# Altium project T245_1v1.PrjPcb
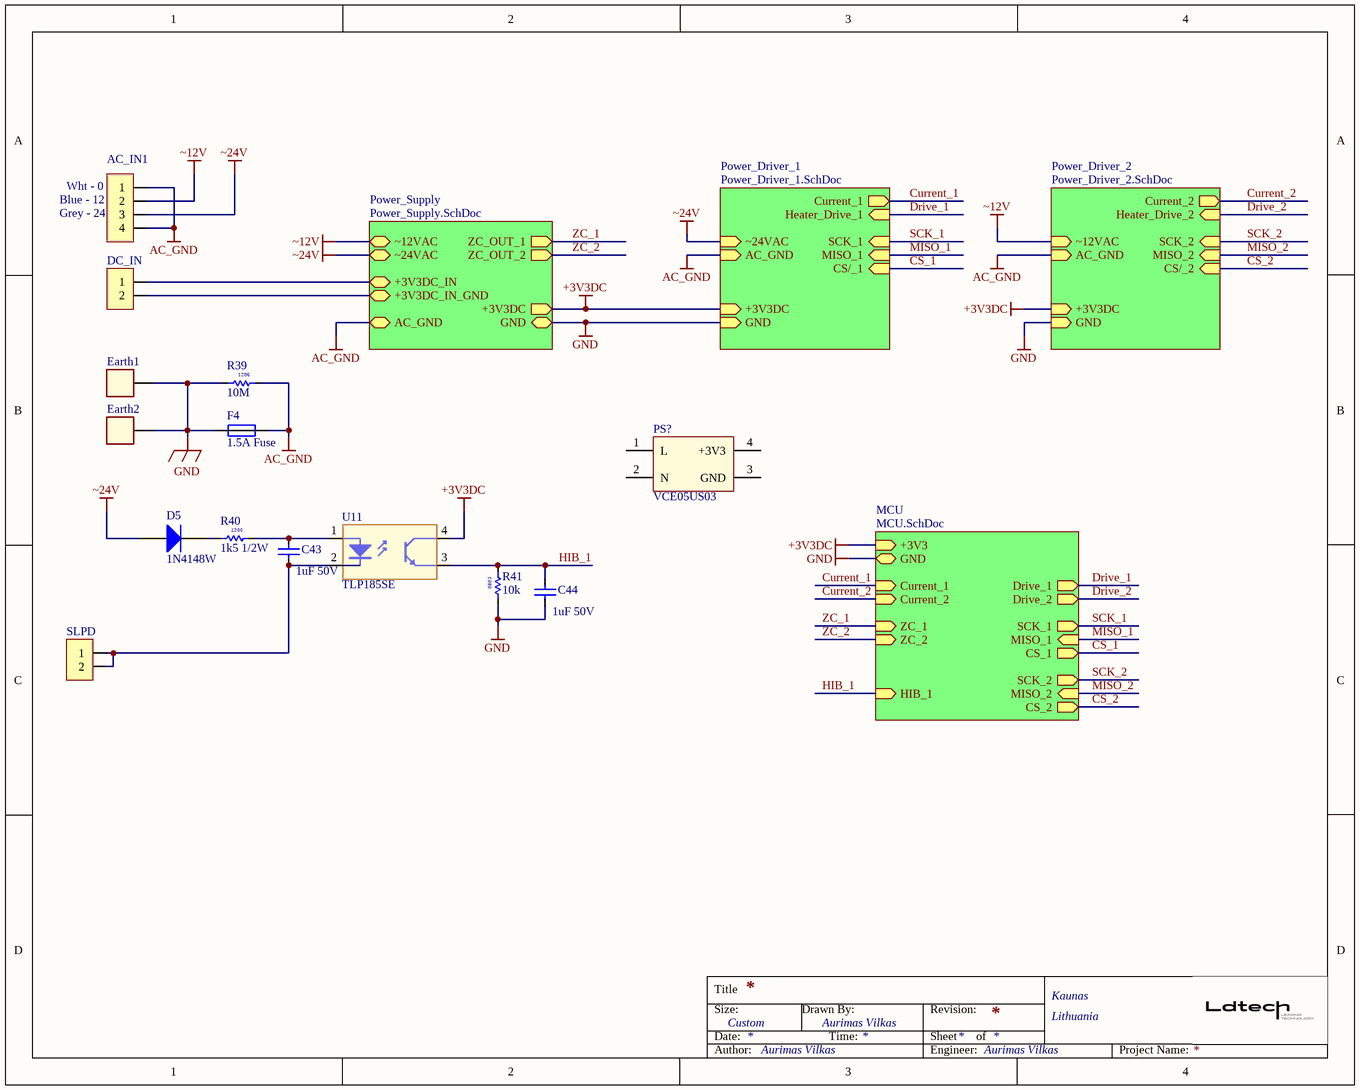
[diagram p0: T245_1v1.SchDoc]
5 sheets, 139 parts. Net scope: hierarchical (ports join the sheet entries above them; power ports are global).
Board file: T245_1v1.PcbDoc
Sheets:
  T245_1v1.SchDoc
    MCU = MCU.SchDoc
    Power_Supply = Power_Supply.SchDoc
    Power_Driver_1 = Power_Driver_1.SchDoc
    Power_Driver_2 = Power_Driver_2.SchDoc

## Sheet T245_1v1.SchDoc
size 254 x 203 mm; Author: Aurimas Vilkas; DrawnBy: Aurimas Vilkas; Engineer: Aurimas Vilkas

### Parts
AC_IN1  HDR1X4  [HDR1X4_3M96V]  (value not drawn)
C43  1uF 50V  [CAPC2012N]
C44  1uF 50V  [CAPC2012N]
D5  1N4148W  [SOD-123F]
DC_IN  HDR1X2  [HDR1X2_3M96V]  (value not drawn)
Earth1  Blade Header  [Blade header]  (value not drawn)
Earth2  Blade Header  [Blade header]  (value not drawn)
F4  1.5A Fuse  [1206F]
PS?  VCE05US03  [VCE05US03]
R39  10M  [RESC3216N]
R40  1k5 1/2W  [RESC3216N]
R41  10k  [RESC1608N]
SLPD  Sleep_Det  [HDR1X2_2.54mm]  (value not drawn)
U11  TLP185SE  [SOP-4]

### Sub-sheets
MCU = MCU.SchDoc: SCK_2 (out), +3V3 (in), Current_1 (in), Drive_2 (out), CS_1 (out), Current_2 (in), MISO_1 (in), MISO_2 (in), ZC_2 (in), CS_2 (out), SCK_1 (out), ZC_1 (in), Drive_1 (out), GND (bidir), HIB_1 (in)
Power_Driver_1 = Power_Driver_1.SchDoc: GND (in), ~24VAC (in), Current_1 (out), SCK_1 (in), +3V3DC (in), AC_GND (in), Heater_Drive_1 (in), CS/_1 (in), MISO_1 (in)
Power_Driver_2 = Power_Driver_2.SchDoc: Current_2 (out), Heater_Drive_2 (in), +3V3DC (in), AC_GND (in), MISO_2 (in), GND (in), CS/_2 (in), SCK_2 (in), ~12VAC (in)
Power_Supply = Power_Supply.SchDoc: +3V3DC (out), GND (bidir), ~24VAC (bidir), AC_GND (bidir), ZC_OUT_2 (out), ZC_OUT_1 (out), +3V3DC_IN (bidir), +3V3DC_IN_GND (bidir), ~12VAC (bidir)

### Nets
+3V3DC: U11.4(C) ; sheet MCU/+3V3, sheet Power_Supply/+3V3DC, sheet Power_Driver_1/+3V3DC, sheet Power_Driver_2/+3V3DC  [project net +3V3]
AC_GND: AC_IN1.1 AC_IN1.4 F4.1 R39.2 ; sheet Power_Supply/AC_GND, sheet Power_Driver_1/AC_GND, sheet Power_Driver_2/AC_GND  [project net TC_NEG_1]
GND: C44.2 Earth1.1 Earth2.1 F4.2 R39.1 R41.1 ; sheet MCU/GND, sheet Power_Supply/GND, sheet Power_Driver_1/GND, sheet Power_Driver_2/GND
~12V: AC_IN1.2 ; sheet Power_Supply/~12VAC, sheet Power_Driver_2/~12VAC
~24V: AC_IN1.3 D5.2 ; sheet Power_Supply/~24VAC, sheet Power_Driver_1/~24VAC
CS_1: sheet MCU/CS_1, sheet Power_Driver_1/CS/_1
CS_2: sheet MCU/CS_2, sheet Power_Driver_2/CS/_2
Current_1: sheet MCU/Current_1, sheet Power_Driver_1/Current_1
Current_2: sheet MCU/Current_2, sheet Power_Driver_2/Current_2
Drive_1: sheet MCU/Drive_1, sheet Power_Driver_1/Heater_Drive_1
Drive_2: sheet MCU/Drive_2, sheet Power_Driver_2/Heater_Drive_2
HIB_1: C44.1 R41.2 U11.3(E) ; sheet MCU/HIB_1
MISO_1: sheet MCU/MISO_1, sheet Power_Driver_1/MISO_1
MISO_2: sheet MCU/MISO_2, sheet Power_Driver_2/MISO_2
SCK_1: sheet MCU/SCK_1, sheet Power_Driver_1/SCK_1
SCK_2: sheet MCU/SCK_2, sheet Power_Driver_2/SCK_2
ZC_1: sheet MCU/ZC_1, sheet Power_Supply/ZC_OUT_1
ZC_2: sheet MCU/ZC_2, sheet Power_Supply/ZC_OUT_2
NetC35_1: DC_IN.2 ; sheet Power_Supply/+3V3DC_IN_GND
NetC43_1: C43.1 R40.2 U11.1(A)
NetC43_2: C43.2 SLPD.1 SLPD.2 U11.2(K)
NetD5_1: D5.1 R40.1
NetDC_IN_1: DC_IN.1 ; sheet Power_Supply/+3V3DC_IN

Not connected (* = marked no-connect by the designer): PS? 1(L) 2(N) 3(GND) 4(+3V3)

### Notes on the sheet
- (near AC_IN1) Blue - 12
- (near AC_IN1) Grey - 24
- (near AC_IN1) Wht - 0
- Title
- Size:
- Date:
- Custom
- Drawn By:
- Time:
- Revision:
- Sheet
- of
- Kaunas
- Lithuania
- Author:
- Engineer:
- Project Name:
- (in symbol R0000008) 0603
- (in symbol R2412076) 1206
- (in symbol R2412168) 1206

### Library data of the parts
AC_IN1 = J0000151: CONNECTOR, 4 way , HEADER, THT, 3.96MM,10A,250Vac; Supplier 1: Farnell; Supplier Part Number 1: 9492020
C43 C44 = C0000037: CL21B105KBFNNNE -  SMD Multilayer Ceramic Capacitor, 1 µF, 50 V, 0805 [2012 Metric], ± 10%, X7R, CL Series; Supplier 1: Farnell; Supplier Part Number 1: 3013482
D5 = 1N4148W: 1N4148W -  Small Signal Diode, Single, 75 V, 150 mA, 1 V, 4 ns, 400 mA; Supplier Part Number 1: 2677464; Supplier: Farnell
DC_IN = J0000152: CONNECTOR, 2 way , HEADER, THT, 3.96MM,10A,250Vac; Supplier 1: Farnell; Supplier Part Number 1: 9492003
Earth1 Earth2 = Blade Header: 62409-1 -  PCB Terminal, 6.35mm x 0.81mm, 0.25" x 0.032", Brass, 1.4 mm, Tin; Supplier 1: Farnell; Supplier Part Number 1: 892609
F4 = 1.5A Fuse: MCCFB1206TFF/1.5 -  Fuse, Surface Mount, 1.5 A, 32 V, Fast Acting, 1206; Supplier 1: Farnell; Supplier Part Number 1: 1652166
PS? = VCE05US03: VCE05US03 -  AC/DC PCB Mount Power Supply (PSU), ITE, 1 Output, 5 W, 3.3 V, 1.21 A; Supplier 1: Farnell; Supplier Part Number 1: 2671557
R39 = R2412168: CRGCQ1206J10M -  SMD Chip Resistor, 1206 [3216 Metric], 10 Mohm, CRGCQ Series, 200 V, Thick Film, 250 mW; Supplier 1: Farnell; Supplier Part Number 1: 2861974
R40 = R2412076: MCWF12P1501FTL -  SMD Chip Resistor, 1206 [3216 Metric], 1.5 kohm, MCWF12P Series, 200 V, Thick Film, 500 mW; Supplier 1: Farnell; Supplier Part Number 1: 2694448
R41 = R0000008: MCWR06X1002FTL -  SMD Chip Resistor, 0603 [1608 Metric], 10 kohm, MCWR Series, 50 V, Thick Film, 100 mW; Supplier 1: Farnell; Supplier Part Number 1: 2447230
SLPD = J0000013: 2 header, 2.54mm; Supplier 1: Farnell; Supplier Part Number 1: 1248140
U11 = TLP185SE: TLP185(GR-TPL,SE(T -  Optocoupler, 1 Channel, SOP, 4 Pins, 50 mA, 3.75 kV, 100 %; Supplier 1: Farnell; Supplier Part Number 1: 3014097

## Sheet MCU.SchDoc
size 254 x 203 mm; Author: Aurimas Vilkas; DrawnBy: Aurimas Vilkas; Engineer: Aurimas Vilkas
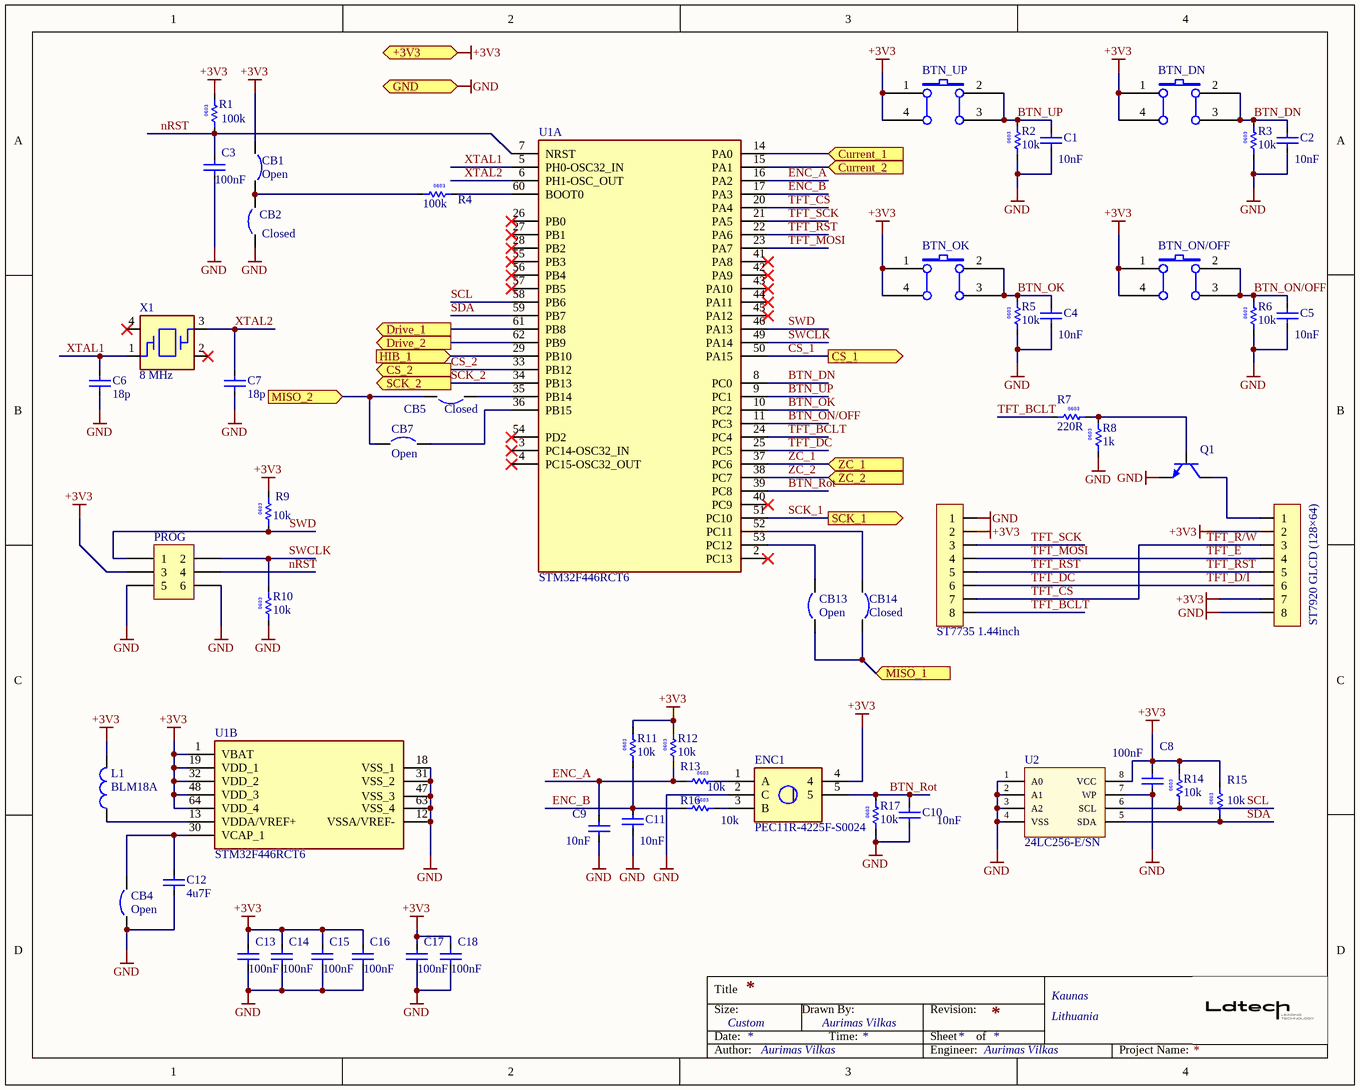
[diagram p1: MCU.SchDoc]

### Parts
BTN_DN  Button  [PB-6X6mm]  (value not drawn)
BTN_OK  Button  [PB-6X6mm]  (value not drawn)
BTN_ON/OFF  Button  [PB-6X6mm]  (value not drawn)
BTN_UP  Button  [PB-6X6mm]  (value not drawn)
C1  10nF  [CAPC1608N]
C2  10nF  [CAPC1608N]
C3  100nF  [CAPC1608N]
C4  10nF  [CAPC1608N]
C5  10nF  [CAPC1608N]
C6  18p  [CAPC1608N]
C7  18p  [CAPC1608N]
C8  100nF  [CAPC1608N]
C9  10nF  [CAPC1608N]
C10  10nF  [CAPC1608N]
C11  10nF  [CAPC1608N]
C12  4u7F  [CAPC1608N]
C13  100nF  [CAPC1608N]
C14  100nF  [CAPC1608N]
C15  100nF  [CAPC1608N]
C16  100nF  [CAPC1608N]
C17  100nF  [CAPC1608N]
C18  100nF  [CAPC1608N]
CB1  Open  [CB_0603]
CB2  Closed  [CB_0603]
CB4  Open  [CB_0603]
CB5  Closed  [CB_0603]
CB7  Open  [CB_0603]
CB13  Open  [CB_0603]
CB14  Closed  [CB_0603]
ENC1  PEC11R-4225F-S0024  [PEC12R-4XXXF-SXXXX_1]
L1  BLM18A  [0603L]
PROG  PROG  [B6B_SMT]  (value not drawn)
Q1  FMMT493ATA  [SOT23-3]  (value not drawn)
R1  100k  [RESC1608N]
R2  10k  [RESC1608N]
R3  10k  [RESC1608N]
R4  100k  [RESC1608N]
R5  10k  [RESC1608N]
R6  10k  [RESC1608N]
R7  220R  [RESC1608N]
R8  1k  [RESC1608N]
R9  10k  [RESC1608N]
R10  10k  [RESC1608N]
R11  10k  [RESC1608N]
R12  10k  [RESC1608N]
R13  10k  [RESC1608N]
R14  10k  [RESC1608N]
R15  10k  [RESC1608N]
R16  10k  [RESC1608N]
R17  10k  [RESC1608N]
ST7735_1.44inch  ST7735 1.44inch  [B8B-XH-A (LF)(SN)]  (value not drawn)
ST7920_GLCD_(128×64)  ST7920 GLCD (128×64)  [B8B-XH-A (LF)(SN)]  (value not drawn)
U1  STM32F446RCT6  [LQFP-64N]  (parts A,B of 2)
U2  24LC256-E/SN  [SOIC-8]
X1  8 MHz  [2SMX-3SMXB]

### Ports
+3V3 (in), CS_1 (out), CS_2 (out), Current_1 (in), Current_2 (in), Drive_1 (out), Drive_2 (out), GND (bidir), HIB_1 (in), MISO_1 (in), MISO_2 (in), SCK_1 (out), SCK_2 (out), ZC_1 (in), ZC_2 (in)

### Nets
+3V3: BTN_DN.1(A0) BTN_DN.4(A1) BTN_OK.1(A0) BTN_OK.4(A1) BTN_ON/OFF.1(A0) BTN_ON/OFF.4(A1) BTN_UP.1(A0) BTN_UP.4(A1) C8.2 C13.2 C14.2 C15.2 C16.2 C17.2 C18.2 CB1.1 ENC1.4 L1.2 PROG.3 R1.2 R9.2 R11.2 R12.2 R14.2 R15.2 ST7735_1.44inch.2 ST7920_GLCD_(128×64).2 ST7920_GLCD_(128×64).7 U1.1(VBAT) U1.19(VDD_1) U1.32(VDD_2) U1.48(VDD_3) U1.64(VDD_4) U2.8(VCC) ; port +3V3
GND: C1.2 C2.2 C3.1 C4.2 C5.2 C6.1 C7.1 C8.1 C9.2 C10.2 C11.2 C12.1 C13.1 C14.1 C15.1 C16.1 C17.1 C18.1 CB2.1 CB4.1 ENC1.2(C) PROG.5 PROG.6 Q1.2(E) R2.1 R3.1 R5.1 R6.1 R8.1 R10.1 R17.1 ST7735_1.44inch.1 ST7920_GLCD_(128×64).8 U1.12(VSSA/VREF-) U1.18(VSS_1) U1.31(VSS_2) U1.47(VSS_3) U1.63(VSS_4) U2.1(A0) U2.2(A1) U2.3(A2) U2.4(VSS) U2.7(WP) ; port GND
BTN_DN: BTN_DN.2(B0) BTN_DN.3(B1) C2.1 R3.2 U1.8(PC0)
BTN_OK: BTN_OK.2(B0) BTN_OK.3(B1) C4.1 R5.2 U1.10(PC2)
BTN_ON/OFF: BTN_ON/OFF.2(B0) BTN_ON/OFF.3(B1) C5.1 R6.2 U1.11(PC3)
BTN_Rot: C10.1 ENC1.5 R17.2 U1.39(PC8)
BTN_UP: BTN_UP.2(B0) BTN_UP.3(B1) C1.1 R2.2 U1.9(PC1)
CS_1: U1.50(PA15) ; port CS_1
CS_2: U1.33(PB12) ; port CS_2
Current_1: U1.14(PA0) ; port Current_1
Current_2: U1.15(PA1) ; port Current_2
Drive_1: U1.61(PB8) ; port Drive_1
Drive_2: U1.62(PB9) ; port Drive_2
ENC_A: C9.1 R12.1 R13.1 U1.16(PA2)
ENC_B: C11.1 R11.1 R16.1 U1.17(PA3)
HIB_1: U1.29(PB10) ; port HIB_1
MISO_1: CB13.1 CB14.2 ; port MISO_1
MISO_2: CB5.2 CB7.1 ; port MISO_2
nRST: C3.2 PROG.4 R1.1 U1.7(NRST)
SCK_1: U1.51(PC10) ; port SCK_1
SCK_2: U1.34(PB13) ; port SCK_2
SCL: R14.1 U1.58(PB6) U2.6(SCL)
SDA: R15.1 U1.59(PB7) U2.5(SDA)
SWCLK: PROG.2 R10.2 U1.49(PA14)
SWD: PROG.1 R9.1 U1.46(PA13)
TFT_BCLT: R7.1 ST7735_1.44inch.8 U1.24(PC4)
TFT_CS: ST7735_1.44inch.7 ST7920_GLCD_(128×64).3 U1.20(PA4)  [also labelled TFT_R/W]
TFT_D/I: ST7735_1.44inch.6 ST7920_GLCD_(128×64).6 U1.25(PC5)  [also labelled TFT_DC]
TFT_E: ST7735_1.44inch.4 ST7920_GLCD_(128×64).4 U1.23(PA7)  [also labelled TFT_MOSI]
TFT_RST: ST7735_1.44inch.5 ST7920_GLCD_(128×64).5 U1.22(PA6)
TFT_SCK: ST7735_1.44inch.3 U1.21(PA5)
XTAL1: C6.2 U1.5(PH0-OSC32_IN) X1.1
XTAL2: C7.2 U1.6(PH1-OSC_OUT) X1.3
ZC_1: U1.37(PC6) ; port ZC_1
ZC_2: U1.38(PC7) ; port ZC_2
NetC12_2: C12.2 CB4.2 U1.30(VCAP_1)
NetCB1_2: CB1.2 CB2.2 R4.1
NetCB5_1: CB5.1 U1.35(PB14)
NetCB7_2: CB7.2 U1.36(PB15)
NetCB13_2: CB13.2 U1.53(PC12)
NetCB14_1: CB14.1 U1.52(PC11)
NetENC1_1: ENC1.1(A) R13.2
NetENC1_3: ENC1.3(B) R16.2
NetL1_1: L1.1 U1.13(VDDA/VREF+)
NetQ1_1: Q1.1(B) R7.2 R8.2
NetQ1_3: Q1.3(C) ST7920_GLCD_(128×64).1
NetR4_2: R4.2 U1.60(BOOT0)

Not connected (* = marked no-connect by the designer): U1 2(PC13)* 3(PC14-OSC32_IN)* 4(PC15-OSC32_OUT)* 26(PB0)* 27(PB1)* 28(PB2)* 40(PC9)* 41(PA8)* 42(PA9)* 43(PA10)* 44(PA11)* 45(PA12)* 54(PD2)* 55(PB3)* 56(PB4)* 57(PB5)*; X1 2* 4*

### Notes on the sheet
- Title
- Size:
- Date:
- Custom
- Drawn By:
- Time:
- Revision:
- Sheet
- of
- Kaunas
- Lithuania
- Author:
- Engineer:
- Project Name:
- (in symbol R0000008) 0603
- (in symbol R2406056) 0603
- (in symbol R2406120) 0603

### Library data of the parts
BTN_DN BTN_OK BTN_ON/OFF BTN_UP = Tactile PB: FSM2JRT -  Tactile Switch, Non Illuminated, 24 V, 50 mA, 225 gf, PC Pin, FSM Series; Supplier 1: Farnell; Supplier Part Number 1: 2610957
C1 C2 C4 C5 C9-C11 = C0000009: MCU0603R103KCT -  SMD Multilayer Ceramic Capacitor, 10000 pF, 50 V, 0603 [1608 Metric], ± 10%, X7R, MCU Series; Supplier 1: Farnell; Supplier Part Number 1: 9406182
C3 C8 C13-C18 = C0000005: MC0805B104K250CT -  SMD Multilayer Ceramic Capacitor, 0.1 µF, 25 V, 0805 [2012 Metric], ± 10%, X7R, MC Series; Supplier 1: Farnell; Supplier Part Number 1: 1759166
C6 C7 = C0000124: 0603N180J500CT -  SMD Multilayer Ceramic Capacitor, 0603 [1608 Metric], 18 pF, 50 V, ± 5%, C0G / NP0; Supplier 1: Farnell; Supplier Part Number 1: 2496890
C12 = C0000005: CL10A475KQ8NNNC -  SMD Multilayer Ceramic Capacitor, 4.7 µF, 6.3 V, 0603 [1608 Metric], ± 10%, X5R, CL Series; Supplier 1: Farnell; Supplier Part Number 1: 3013399
CB1 CB4 CB7 CB13 = CB Open: Circuit Breaker; Revision: July-2002: Re-released for DXP Platform.
CB2 CB5 CB14 = CB Closed: Circuit Breaker; Revision: July-2002: Re-released for DXP Platform.
ENC1 = PEC11R-4225F-S0024: PEC11R-4225F-S0024 -  Rotary Encoder, Mechanical, Incremental, 24 PPR, 24 Detents, Vertical, With Momentary Push Switch; Supplier Part Number 1: 2381866; Supplier 1: Farnell
L1 = BLM18AG601SN1D: BLM18AG601SN1D -  Ferrite Bead, 0603 [1608 Metric], 600 ohm, 500 mA, BLM18A Series, 0.38 ohm, ± 25%; Supplier 1: Farnell; Supplier Part Number 1: 1515679
PROG = B6B_SMT: 1241050-3 -  Board-To-Board Connector, 2.54 mm, 6 Contacts, Header, AMPMODU MOD II Series, Surface Mount, 2 Rows; Supplier 1: Farnell; Supplier Part Number 1: 9689567
Q1 = FMMT493ATA: FMMT493ATA -  Bipolar (BJT) Single Transistor, NPN, 60 V, 150 MHz, 500 mW, 1 A, 300 hFE; Supplier Part Number 1: 2061448; Supplier 1: Farnell
R1 R4 = R2406120: MCWR06X1003FTL -  SMD Chip Resistor, 0603 [1608 Metric], 100 kohm, MCWR Series, 50 V, Thick Film, 100 mW; Supplier 1: Farnell; Supplier Part Number 1: 2447226RL
R2 R3 R5 R6 R9-R17 = R0000008: as R41 on sheet T245_1v1; Supplier 1: Farnell; Supplier Part Number 1: 2447230
R7 = R2406056: CRGH0603F220R -  SMD Chip Resistor, 220 ohm, CRG Series, 50 V, Thick Film, 0603 [1608 Metric], 200 mW; Supplier 1: Farnell; Supplier Part Number 1: 2331993
R8 = R2406056: CRGH0603F1K0 -  SMD Chip Resistor, 1 kohm, CRG Series, 50 V, Thick Film, 0603 [1608 Metric], 200 mW; Supplier 1: Farnell; Supplier Part Number 1: 2332003
ST7735_1.44inch ST7920_GLCD_(128×64) = B8B-XH-A: B8B-XH-A (LF)(SN) -  Wire-To-Board Connector, Vertical, 2.5 mm, 8 Contacts, Header, XH Series, Through Hole, 1 Rows; Supplier 1: Farnell; Supplier Part Number 1: 1516284
U1 = STM32F446RCT6TR: STM32F446RCT6 -  ARM MCU, High Performance, STM32 Family STM32F4 Series Microcontrollers, ARM Cortex-M4, 32bit; Kitron: 4110530; Supplier 1: Farnell; Supplier Part Number 1: 2488309
U2 = 24LC256-E/SN: 24LC256-E/SN -  EEPROM, 256 Kbit, 32K x 8bit, Serial I2C (2-Wire), 400 kHz, SOIC, 8 Pins; Supplier Part Number 1: 1579573; Supplier 1: Farnell
X1 = M0000014: CRYSTAL, 8M, 18PF CL, 6X3.6MM SMT; Supplier 1: Farnell; Supplier Part Number 1: 1611803

## Sheet Power_Supply.SchDoc
size 254 x 203 mm; Author: Aurimas Vilkas; DrawnBy: Aurimas Vilkas; Engineer: Aurimas Vilkas
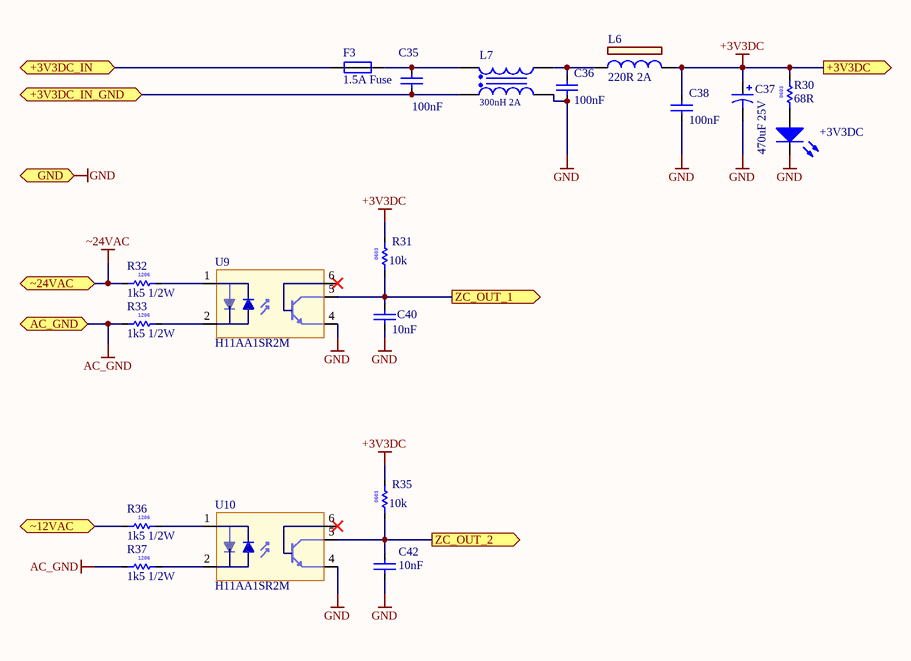
[diagram p2: Power_Supply.SchDoc]

### Parts
+3V3DC  Green LED  [LED_GRN]  (value not drawn)
C35  100nF  [CAPC1608N]
C36  100nF  [CAPC1608N]
C37  470uF 25V  [10X10.5]
C38  100nF  [CAPC1608N]
C40  10nF  [CAPC1608N]
C42  10nF  [CAPC1608N]
F3  1.5A Fuse  [1206F]
L6  220R 2A  [LL0805\2P]
L7  300nH 2A  [1812_CM_WE]
R30  68R  [RESC1608N]
R31  10k  [RESC1608N]
R32  1k5 1/2W  [RESC3216N]
R33  1k5 1/2W  [RESC3216N]
R35  10k  [RESC1608N]
R36  1k5 1/2W  [RESC3216N]
R37  1k5 1/2W  [RESC3216N]
U9  H11AA1SR2M  [SMDIP-6]
U10  H11AA1SR2M  [SMDIP-6]

### Ports
+3V3DC (out), +3V3DC_IN (bidir), +3V3DC_IN_GND (bidir), AC_GND (bidir), GND (bidir), ZC_OUT_1 (out), ZC_OUT_2 (out), ~12VAC (bidir), ~24VAC (bidir)

### Nets
+3V3DC: C37.1 C38.2 L6.2 R30.2 R31.2 R35.2 ; port +3V3DC  [project net +3V3]
AC_GND: R33.1 R37.1 ; port AC_GND  [project net TC_NEG_1]
GND: +3V3DC.2(K) C36.1 C37.2 C38.1 C40.2 C42.2 L7.2 U9.4(E) U10.4(E) ; port GND
~12V: R36.1 ; port ~12VAC
~24VAC: R32.1 ; port ~24VAC  [project net ~24V]
ZC_1: C40.1 R31.1 U9.5(C) ; port ZC_OUT_1
ZC_2: C42.1 R35.1 U10.5(C) ; port ZC_OUT_2
Net+3V3DC_1: +3V3DC.1(A) R30.1
NetC35_1: C35.1 L7.1 ; port +3V3DC_IN_GND
NetC35_2: C35.2 F3.2 L7.4
NetC36_2: C36.2 L6.1 L7.3
NetDC_IN_1: F3.1 ; port +3V3DC_IN
NetR32_2: R32.2 U9.1(A)
NetR33_2: R33.2 U9.2(K)
NetR36_2: R36.2 U10.1(A)
NetR37_2: R37.2 U10.2(K)

Not connected (* = marked no-connect by the designer): U9 6(B)*; U10 6(B)*

### Notes on the sheet
- Title
- Size:
- Date:
- Custom
- Drawn By:
- Time:
- Revision:
- Sheet
- of
- Kaunas
- Lithuania
- Author:
- Engineer:
- Project Name:
- (in symbol R0000002) 0603
- (in symbol R0000008) 0603
- (in symbol R2412076) 1206

### Library data of the parts
+3V3DC = KPT-2012SGC: KPT-2012SGC -  LED, Low Power, Green, SMD, 2mm x 1.25mm, 20 mA, 2.2 V, 568 nm; Supplier 1: Farnell; Supplier Part Number 1: 2099239
C35 C36 C38 = C0000005: as C3 on sheet MCU; Supplier 1: Farnell; Supplier Part Number 1: 1759166
C37 = 470uF 25V: MCVVT025M471GB3L -  SMD Aluminium Electrolytic Capacitor, Radial Can - SMD, 470 µF, 25 V, VT, V-Chip Series; Supplier 1: Farnell; Supplier Part Number 1: 2611378
C40 C42 = C0000009: as C1 on sheet MCU; Supplier 1: Farnell; Supplier Part Number 1: 9406182
F3 = 1.5A Fuse: as F4 on sheet T245_1v1; Supplier 1: Farnell; Supplier Part Number 1: 1652166
L6 = L0000004: BLM21PG221SN1D -  Ferrite Bead, 0805 [2012 Metric], 220 ohm, 2 A, BLM21P Series, 0.045 ohm, ± 25%; Supplier 1: Farnell; Supplier Part Number 1: 1515661
L7 = 300 nH: 744235900 -  Filter, Line, Common Mode, 300 nH, WE-CNSW Series, 90 ohm, 2 A, 4.5mm x 3.2mm x 2.8mm; Supplier 1: Farnell; Supplier Part Number 1: 2249865
R30 = R0000002: MCSR06X68R0FTL -  SMD Chip Resistor, 68 ohm, MCSR 06 Series, 75 V, Ceramic, 0603 [1608 Metric], 100 mW; Supplier 1: Farnell; Supplier Part Number 1: 2074301
R31 R35 = R0000008: as R41 on sheet T245_1v1; Supplier 1: Farnell; Supplier Part Number 1: 2447230
R32 R33 R36 R37 = R2412076: as R40 on sheet T245_1v1; Supplier 1: Farnell; Supplier Part Number 1: 2694448
U9 U10 = H11AA1SR2M: H11AA1SR2M -  Optocoupler, Transistor Output, 1 Channel, Surface Mount DIP, 6 Pins, 60 mA, 7.5 kV, 20 %; Supplier 1: Farnell; Supplier Part Number 1: 2322525

## Sheet Power_Driver_1.SchDoc
size 254 x 203 mm; Author: Aurimas Vilkas; DrawnBy: Aurimas Vilkas; Engineer: Aurimas Vilkas
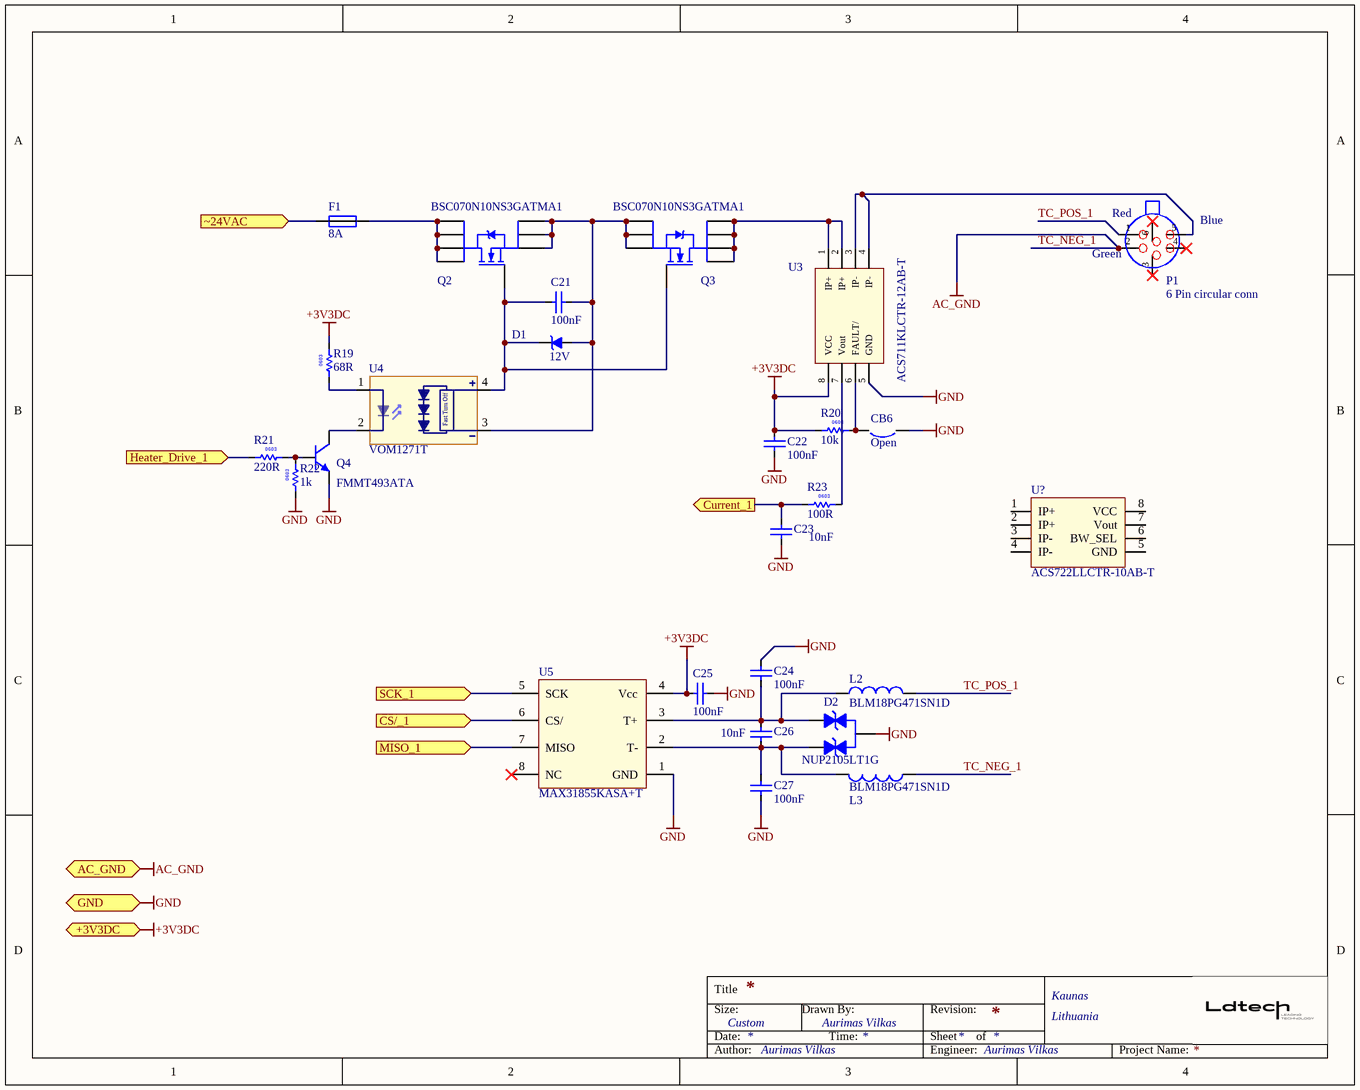
[diagram p3: Power_Driver_1.SchDoc]

### Parts
C21  100nF  [CAPC1608N]
C22  100nF  [CAPC1608N]
C23  10nF  [CAPC1608N]
C24  100nF  [CAPC1608N]
C25  100nF  [CAPC1608N]
C26  10nF  [CAPC1608N]
C27  100nF  [CAPC1608N]
CB6  Open  [CB_0603]
D1  12V  [SOD-80C]
D2  NUP2105LT1G  [SOT23-3]
F1  8A  [1206F]
L2  BLM18PG471SN1D  [LL0603\2P]
L3  BLM18PG471SN1D  [LL0603\2P]
P1  6 Pin circular conn  [RPC1-12RB-6P(71)]
Q2  BSC070N10NS3GATMA1  [PG-TDSON-8]
Q3  BSC070N10NS3GATMA1  [PG-TDSON-8]
Q4  FMMT493ATA  [SOT23-3]
R19  68R  [RESC1608N]
R20  10k  [RESC1608N]
R21  220R  [RESC1608N]
R22  1k  [RESC1608N]
R23  100R  [RESC1608N]
U3  ACS711KLCTR-12AB-T  [SOIC-8]
U4  VOM1271T  [SOP-4]
U5  MAX31855KASA+T  [SOIC-8]
U?  ACS722LLCTR-10AB-T  [SOIC-8]

### Ports
+3V3DC (in), AC_GND (in), CS/_1 (in), Current_1 (out), GND (in), Heater_Drive_1 (in), MISO_1 (in), SCK_1 (in), ~24VAC (in)

### Nets
+3V3DC: C22.2 C25.1 R19.2 R20.1 U3.8(VCC) U5.4(Vcc) ; port +3V3DC  [project net +3V3]
GND: C22.1 C23.2 C24.2 C25.2 C27.1 CB6.1 D2.3 Q4.2(E) R22.1 U3.5(GND) U5.1(GND) ; port GND
TC_NEG_1: L3.1 P1.2 ; port AC_GND  [also labelled AC_GND]
~24V: F1.2 ; port ~24VAC
CS_1: U5.6(CS/) ; port CS/_1
Current_1: C23.1 R23.1 ; port Current_1
Drive_1: R21.1 ; port Heater_Drive_1
MISO_1: U5.7(MISO) ; port MISO_1
SCK_1: U5.5(SCK) ; port SCK_1
TC_POS_1: L2.2 P1.1
NetC21_1: C21.1 D1.2(A) Q2.3(S) Q3.3(S) U4.3(K)
NetC21_2: C21.2 D1.1(K) Q2.1(G) Q3.1(G) U4.4(E)
NetC24_1: C24.1 C26.1 D2.2 L2.1 U5.3(T+)
NetC26_2: C26.2 C27.2 D2.1 L3.2 U5.2(T-)
NetCB6_2: CB6.2 R20.2 U3.6(FAULT/)
NetF1_1: F1.1 Q2.2(D)
NetP1_5: P1.5 U3.3(IP-) U3.4(IP-)
NetQ3_2: Q3.2(D) U3.1(IP+) U3.2(IP+)
NetQ4_1: Q4.1(B) R21.2 R22.2
NetQ4_3: Q4.3(C) U4.2(K)
NetR19_1: R19.1 U4.1(A)
NetR23_2: R23.2 U3.7(Vout)

Not connected (* = marked no-connect by the designer): P1 3* 4* 6*; U5 8(NC)*; U? 1(IP+) 2(IP+) 3(IP-) 4(IP-) 5(GND) 6(BW_SEL) 7(Vout) 8(VCC)

### Notes on the sheet
- (near P1) Red
- (near P1) Blue
- (near P1) Green
- Title
- Size:
- Date:
- Custom
- Drawn By:
- Time:
- Revision:
- Sheet
- of
- Kaunas
- Lithuania
- Author:
- Engineer:
- Project Name:
- (in symbol R0000002) 0603
- (in symbol R0000008) 0603
- (in symbol R2406048) 0603
- (in symbol R2406056) 0603
- (in symbol VOM1271T) Fast Turn Off

### Library data of the parts
C21 C22 C24 C25 C27 = C0000005: as C3 on sheet MCU; Supplier 1: Farnell; Supplier Part Number 1: 1759166
C23 C26 = C0000009: as C1 on sheet MCU; Supplier 1: Farnell; Supplier Part Number 1: 9406182
CB6 = CB Open: Circuit Breaker; Revision: July-2002: Re-released for DXP Platform.
D1 = 12V: BZT55C12-GS08 -  Zener Single Diode, 12 V, 500 mW, SOD-80 (MiniMELF), 5 %, 2 Pins, 175 °C; Supplier 1: Farnell; Supplier Part Number 1: 2690028
D2 = NUP2105LT1G: NUP2105LT1G -  TVS Diode, NUP21 Series, Bidirectional, 22 V, 40 V, SOT-23, 3 Pins; Supplier Part number 1: 2101833; Supplier 1: Farnell
F1 = 8A Fuse: MCCFB1206TFF/8 -  Fuse, Surface Mount, 8 A, 32 V, Fast Acting, 1206; Supplier Part Number 1: 2850026; Supplier 1: Farnell
L2 L3 = L0000158: BLM18PG471SN1D -  Ferrite Bead, 0603 [1608 Metric], 470 ohm, 1 A, BLM18P Series, 0.2 ohm, ± 25%; Supplier 1: Farnell; Supplier Part Number 1: 1515745
P1 = RPC1-12RB-6P(71): RPC1-12RB-6P(71) -  Circular Connector, RP Series, Panel Mount Receptacle, 6 Contacts, Solder Pin; Supplier Part Number 1: 1077728; Supplier 1: Farnell
Q2 Q3 = BSC070N10NS3GATMA1: BSC070N10NS3GATMA1 -  Power MOSFET, N Channel, 100 V, 90 A, 0.0063 ohm, TDSON, Surface Mount; Kitron: 4084118; Supplier Part Number 1: 2443421; Supplier 1: Farnell
Q4 = FMMT493ATA: as Q1 on sheet MCU; Supplier Part Number 1: 2061448; Supplier 1: Farnell
R19 = R0000002: as R30 on sheet Power_Supply; Supplier 1: Farnell; Supplier Part Number 1: 2074301
R20 = R0000008: as R41 on sheet T245_1v1; Supplier 1: Farnell; Supplier Part Number 1: 2447230
R21 = R2406056: as R7 on sheet MCU; Supplier 1: Farnell; Supplier Part Number 1: 2331993
R22 = R2406056: as R8 on sheet MCU; Supplier 1: Farnell; Supplier Part Number 1: 2332003
R23 = R2406048: MCHVR03JTEX1000 -  SMD Chip Resistor, High Voltage, 100 ohm, HVR Series, 200 V, Thick Film, 0603 [1608 Metric], 100 mW; Supplier 1: Farnell; Supplier Part Number 1: 2825696
U3 = ACS711KLCTR-12AB-T: ACS711KLCTR-12AB-T -  Current Sensor, Overcurrent Fault, 4 mA, 100 kHz, SOIC, 8 Pins, 3 V, 5.5 V; Supplier Part Number 1: 2057423; Supplier 1: Farnell
U4 = VOM1271T: VOM1271T -  Photovoltaic MOSFET Driver, Integrated Fast Turn-Off, Solid-State Relay 47µA Out, 24 µs Delay, SOP-4; Supplier Part Number 1: 2395899; Supplier 1: Farnell
U5 = MAX31855KASA+T: MAX31855KASA+T -  Temperature Sensor IC, Thermocouple, Digital, ± 2°C, -200 °C, 1350 °C, NSOIC, 8 Pins; Supplier 1: Farnell; Supplier Part Number 1: 2515622
U? = ACS722LLCTR-10AB-T: SENSOR CURRENT HALL 10A AC/DC; Supplier 1: Digi-Key

## Sheet Power_Driver_2.SchDoc
size 254 x 203 mm; Author: Aurimas Vilkas; DrawnBy: Aurimas Vilkas; Engineer: Aurimas Vilkas
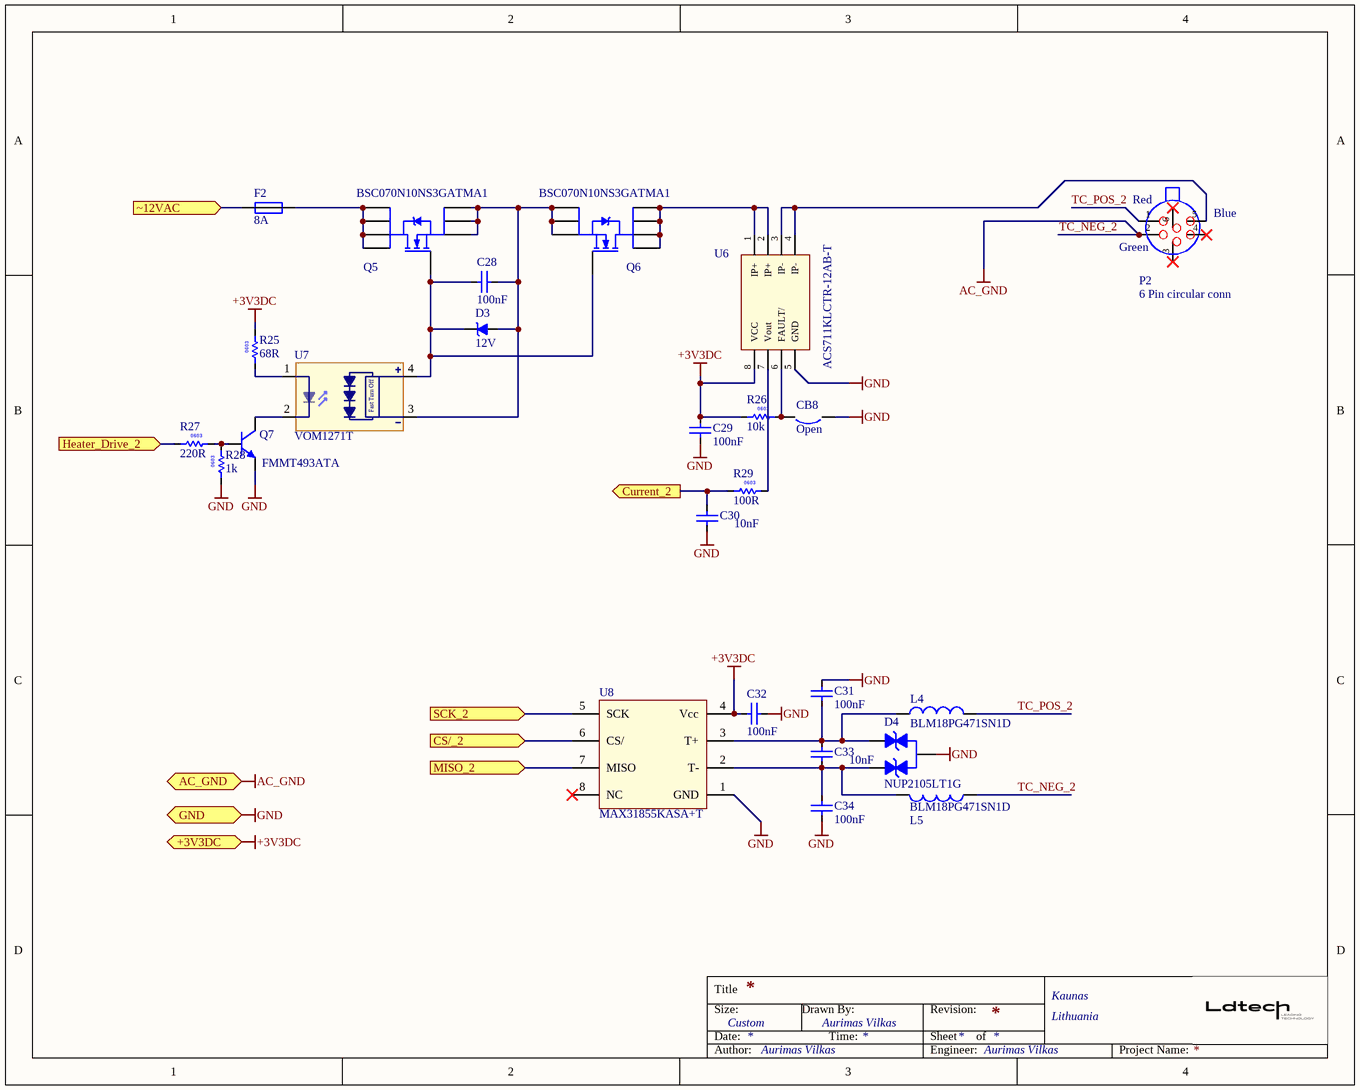
[diagram p4: Power_Driver_2.SchDoc]

### Parts
C28  100nF  [CAPC1608N]
C29  100nF  [CAPC1608N]
C30  10nF  [CAPC1608N]
C31  100nF  [CAPC1608N]
C32  100nF  [CAPC1608N]
C33  10nF  [CAPC1608N]
C34  100nF  [CAPC1608N]
CB8  Open  [CB_0603]
D3  12V  [SOD-80C]
D4  NUP2105LT1G  [SOT23-3]
F2  8A  [1206F]
L4  BLM18PG471SN1D  [LL0603\2P]
L5  BLM18PG471SN1D  [LL0603\2P]
P2  6 Pin circular conn  [RPC1-12RB-6P(71)]
Q5  BSC070N10NS3GATMA1  [PG-TDSON-8]
Q6  BSC070N10NS3GATMA1  [PG-TDSON-8]
Q7  FMMT493ATA  [SOT23-3]
R25  68R  [RESC1608N]
R26  10k  [RESC1608N]
R27  220R  [RESC1608N]
R28  1k  [RESC1608N]
R29  100R  [RESC1608N]
U6  ACS711KLCTR-12AB-T  [SOIC-8]
U7  VOM1271T  [SOP-4]
U8  MAX31855KASA+T  [SOIC-8]

### Ports
+3V3DC (in), AC_GND (in), CS/_2 (in), Current_2 (out), GND (in), Heater_Drive_2 (in), MISO_2 (in), SCK_2 (in), ~12VAC (in)

### Nets
+3V3DC: C29.2 C32.1 R25.2 R26.1 U6.8(VCC) U8.4(Vcc) ; port +3V3DC  [project net +3V3]
AC_GND: L5.1 P2.2 ; port AC_GND  [also labelled TC_NEG_2]  [project net TC_NEG_1]
GND: C29.1 C30.2 C31.2 C32.2 C34.1 CB8.1 D4.3 Q7.2(E) R28.1 U6.5(GND) U8.1(GND) ; port GND
~12V: F2.2 ; port ~12VAC
CS_2: U8.6(CS/) ; port CS/_2
Current_2: C30.1 R29.1 ; port Current_2
Drive_2: R27.1 ; port Heater_Drive_2
MISO_2: U8.7(MISO) ; port MISO_2
SCK_2: U8.5(SCK) ; port SCK_2
TC_POS_2: L4.2 P2.1
NetC28_1: C28.1 D3.2(A) Q5.3(S) Q6.3(S) U7.3(K)
NetC28_2: C28.2 D3.1(K) Q5.1(G) Q6.1(G) U7.4(E)
NetC31_1: C31.1 C33.1 D4.2 L4.1 U8.3(T+)
NetC33_2: C33.2 C34.2 D4.1 L5.2 U8.2(T-)
NetCB8_2: CB8.2 R26.2 U6.6(FAULT/)
NetF2_1: F2.1 Q5.2(D)
NetP2_5: P2.5 U6.3(IP-) U6.4(IP-)
NetQ6_2: Q6.2(D) U6.1(IP+) U6.2(IP+)
NetQ7_1: Q7.1(B) R27.2 R28.2
NetQ7_3: Q7.3(C) U7.2(K)
NetR25_1: R25.1 U7.1(A)
NetR29_2: R29.2 U6.7(Vout)

Not connected (* = marked no-connect by the designer): P2 3* 4* 6*; U8 8(NC)*

### Notes on the sheet
- (near P2) Red
- (near P2) Blue
- (near P2) Green
- Title
- Size:
- Date:
- Custom
- Drawn By:
- Time:
- Revision:
- Sheet
- of
- Kaunas
- Lithuania
- Author:
- Engineer:
- Project Name:
- (in symbol R0000002) 0603
- (in symbol R0000008) 0603
- (in symbol R2406048) 0603
- (in symbol R2406056) 0603
- (in symbol VOM1271T) Fast Turn Off

### Library data of the parts
C28 C29 C31 C32 C34 = C0000005: as C3 on sheet MCU; Supplier 1: Farnell; Supplier Part Number 1: 1759166
C30 C33 = C0000009: as C1 on sheet MCU; Supplier 1: Farnell; Supplier Part Number 1: 9406182
CB8 = CB Open: Circuit Breaker; Revision: July-2002: Re-released for DXP Platform.
D3 = 12V: as D1 on sheet Power_Driver_1; Supplier 1: Farnell; Supplier Part Number 1: 2690028
D4 = NUP2105LT1G: as D2 on sheet Power_Driver_1; Supplier Part number 1: 2101833; Supplier 1: Farnell
F2 = 8A Fuse: as F1 on sheet Power_Driver_1; Supplier Part Number 1: 2850026; Supplier 1: Farnell
L4 L5 = L0000158: as L2 on sheet Power_Driver_1; Supplier 1: Farnell; Supplier Part Number 1: 1515745
P2 = RPC1-12RB-6P(71): as P1 on sheet Power_Driver_1; Supplier Part Number 1: 1077728; Supplier 1: Farnell
Q5 Q6 = BSC070N10NS3GATMA1: as Q2 on sheet Power_Driver_1; Supplier Part Number 1: 2443421; Supplier 1: Farnell
Q7 = FMMT493ATA: as Q1 on sheet MCU; Supplier Part Number 1: 2061448; Supplier 1: Farnell
R25 = R0000002: as R30 on sheet Power_Supply; Supplier 1: Farnell; Supplier Part Number 1: 2074301
R26 = R0000008: as R41 on sheet T245_1v1; Supplier 1: Farnell; Supplier Part Number 1: 2447230
R27 = R2406056: as R7 on sheet MCU; Supplier 1: Farnell; Supplier Part Number 1: 2331993
R28 = R2406056: as R8 on sheet MCU; Supplier 1: Farnell; Supplier Part Number 1: 2332003
R29 = R2406048: as R23 on sheet Power_Driver_1; Supplier 1: Farnell; Supplier Part Number 1: 2825696
U6 = ACS711KLCTR-12AB-T: as U3 on sheet Power_Driver_1; Supplier Part Number 1: 2057423; Supplier 1: Farnell
U7 = VOM1271T: as U4 on sheet Power_Driver_1; Supplier Part Number 1: 2395899; Supplier 1: Farnell
U8 = MAX31855KASA+T: as U5 on sheet Power_Driver_1; Supplier 1: Farnell; Supplier Part Number 1: 2515622

## Nets that join several sheets
+3V3: T245_1v1 (U11.4), MCU (34 pins), Power_Supply (6 pins), Power_Driver_1 (6 pins), Power_Driver_2 (6 pins)
GND: T245_1v1 (6 pins), MCU (43 pins), Power_Supply (9 pins), Power_Driver_1 (11 pins), Power_Driver_2 (11 pins)
TC_NEG_1: T245_1v1 (AC_IN1.1 AC_IN1.4 F4.1 R39.2), Power_Supply (R33.1 R37.1), Power_Driver_1 (L3.1 P1.2), Power_Driver_2 (L5.1 P2.2)
~12V: T245_1v1 (AC_IN1.2), Power_Supply (R36.1), Power_Driver_2 (F2.2)
~24V: T245_1v1 (AC_IN1.3 D5.2), Power_Supply (R32.1), Power_Driver_1 (F1.2)
CS_1: MCU (U1.50), Power_Driver_1 (U5.6)
CS_2: MCU (U1.33), Power_Driver_2 (U8.6)
Current_1: MCU (U1.14), Power_Driver_1 (C23.1 R23.1)
Current_2: MCU (U1.15), Power_Driver_2 (C30.1 R29.1)
Drive_1: MCU (U1.61), Power_Driver_1 (R21.1)
Drive_2: MCU (U1.62), Power_Driver_2 (R27.1)
HIB_1: T245_1v1 (C44.1 R41.2 U11.3), MCU (U1.29)
MISO_1: MCU (CB13.1 CB14.2), Power_Driver_1 (U5.7)
MISO_2: MCU (CB5.2 CB7.1), Power_Driver_2 (U8.7)
NetC35_1: T245_1v1 (DC_IN.2), Power_Supply (C35.1 L7.1)
NetDC_IN_1: T245_1v1 (DC_IN.1), Power_Supply (F3.1)
SCK_1: MCU (U1.51), Power_Driver_1 (U5.5)
SCK_2: MCU (U1.34), Power_Driver_2 (U8.5)
ZC_1: MCU (U1.37), Power_Supply (C40.1 R31.1 U9.5)
ZC_2: MCU (U1.38), Power_Supply (C42.1 R35.1 U10.5)